# EAGLE schematic powersensor (EAGLE 7.7.0)
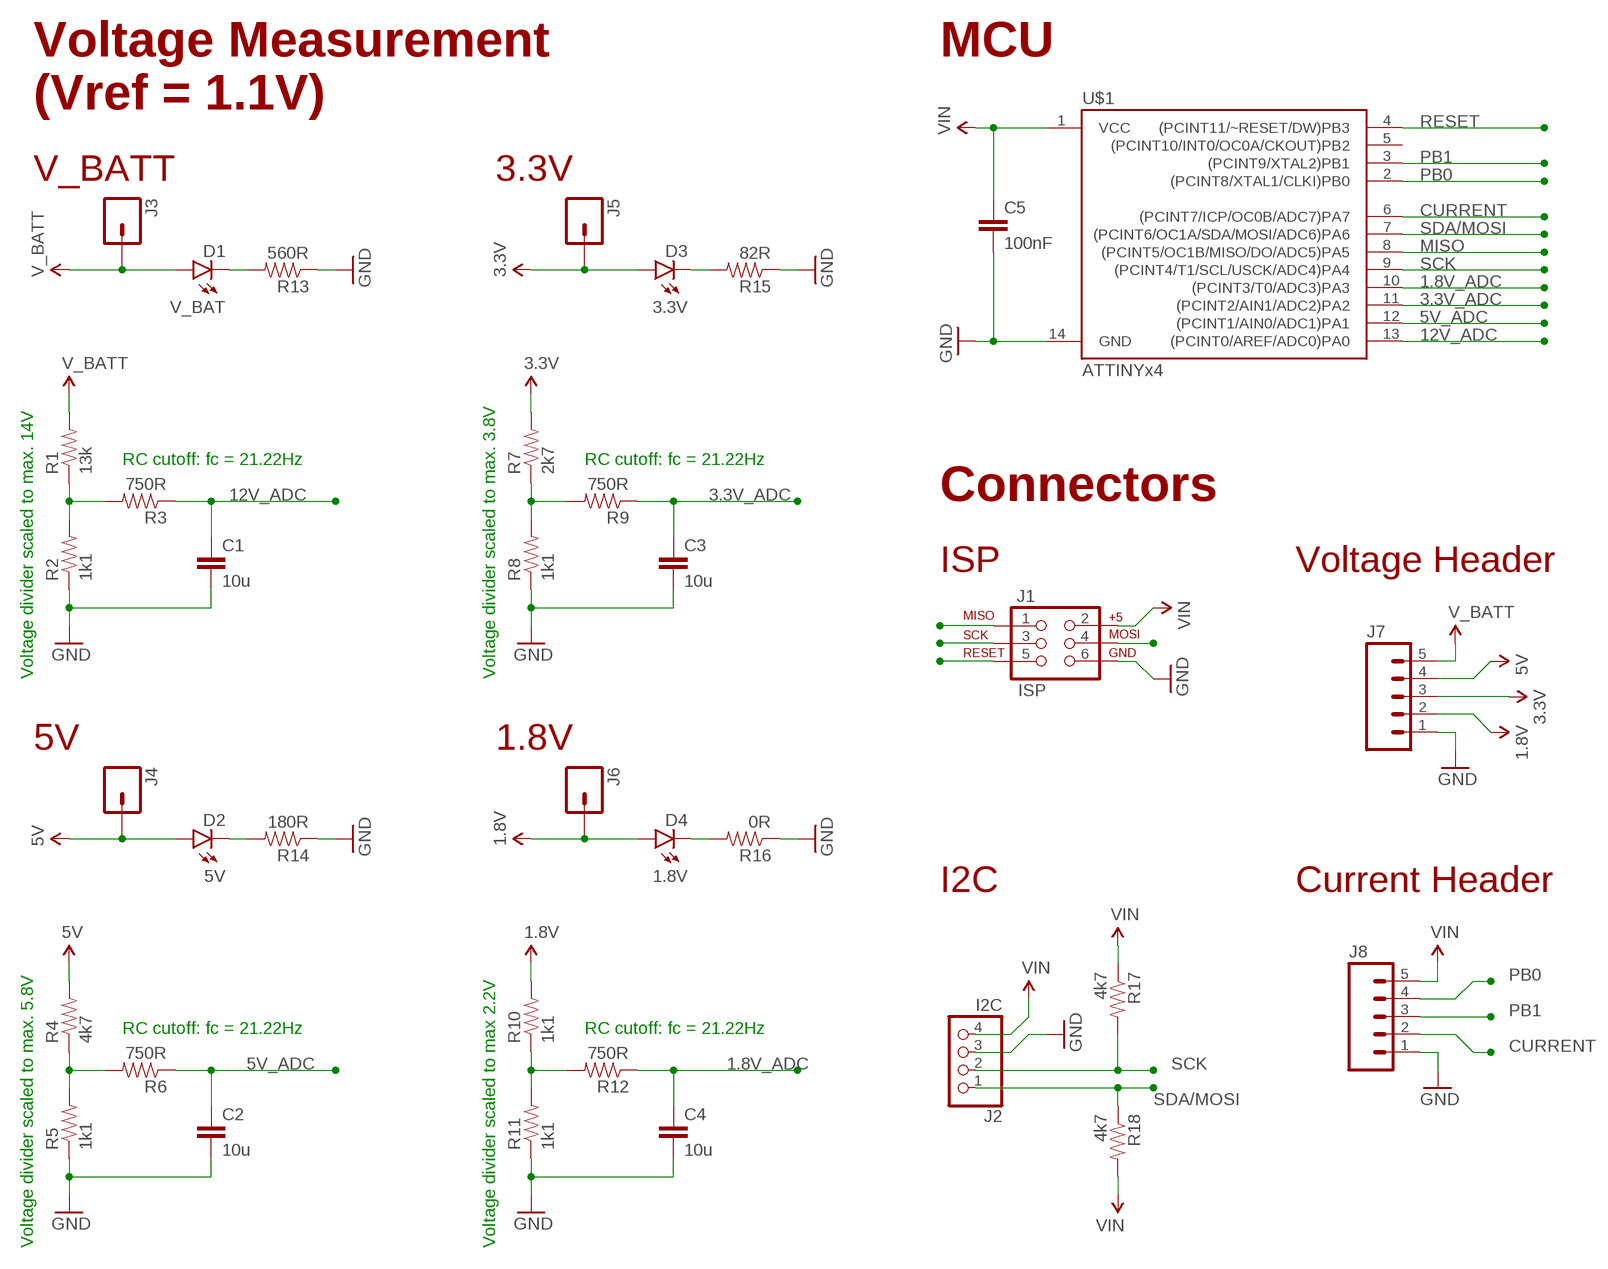
[diagram p0: schematic, sheet 1]

## Parts
C1  10u  CAP0603-CAP  [0603-CAP]
C2  10u  CAP0603-CAP  [0603-CAP]
C3  10u  CAP0603-CAP  [0603-CAP]
C4  10u  CAP0603-CAP  [0603-CAP]
C5  100nF  CAP0603-CAP  [0603-CAP]
D1  V_BAT  LED0603  [LED-0603]
D2  5V  LED0603  [LED-0603]
D3  3.3V  LED0603  [LED-0603]
D4  1.8V  LED0603  [LED-0603]
J1  ISP  AVR_SPI_PRG_6PTH  [2X3]
J2  I2C  PINHD-1X4/90  [1X04/90]
J3  M01PTH  [1X01]
J4  M01PTH  [1X01]
J5  M01PTH  [1X01]
J6  M01PTH  [1X01]
J7  M05PTH  [1X05]
J8  M05PTH  [1X05]
R1  13k  RESISTOR0603-RES  [0603-RES]
R2  1k1  RESISTOR0603-RES  [0603-RES]
R3  750R  RESISTOR0603-RES  [0603-RES]
R4  4k7  RESISTOR0603-RES  [0603-RES]
R5  1k1  RESISTOR0603-RES  [0603-RES]
R6  750R  RESISTOR0603-RES  [0603-RES]
R7  2k7  RESISTOR0603-RES  [0603-RES]
R8  1k1  RESISTOR0603-RES  [0603-RES]
R9  750R  RESISTOR0603-RES  [0603-RES]
R10  1k1  RESISTOR0603-RES  [0603-RES]
R11  1k1  RESISTOR0603-RES  [0603-RES]
R12  750R  RESISTOR0603-RES  [0603-RES]
R13  560R  RESISTOR0603-RES  [0603-RES]
R14  180R  RESISTOR0603-RES  [0603-RES]
R15  82R  RESISTOR0603-RES  [0603-RES]
R16  0R  RESISTOR0603-RES  [0603-RES]
R17  4k7  RESISTOR0603-RES  [0603-RES]
R18  4k7  RESISTOR0603-RES  [0603-RES]
U$1  ATTINYx4  ATTINY84  [SO14]

## Nets
1.8V: D4.A J6.1 J7.2 R10.2
1.8V_ADC: C4.1 R12.1 U$1.10((PCINT3/T0/ADC3)PA3)
3.3V: D3.A J5.1 J7.3 R7.2
3.3V_ADC: C3.1 R9.1 U$1.11((PCINT2/AIN1/ADC2)PA2)
5V: D2.A J4.1 J7.4 R4.2
5V_ADC: C2.1 R6.1 U$1.12((PCINT1/AIN0/ADC1)PA1)
12V_ADC: C1.1 R3.1 U$1.13((PCINT0/AREF/ADC0)PA0)
CURRENT: J8.2 U$1.6((PCINT7/ICP/OC0B/ADC7)PA7)
GND: C1.2 C2.2 C3.2 C4.2 C5.2 J1.6 J2.3 J7.1 J8.1 R2.1 R5.1 R8.1 R11.1 R13.1 R14.1 R15.1 R16.1 U$1.14(GND)
MISO: J1.1 U$1.8((PCINT5/OC1B/MISO/DO/ADC5)PA5)
N$1: R1.1 R2.2 R3.2
N$2: R4.1 R5.2 R6.2
N$3: R7.1 R8.2 R9.2
N$4: R10.1 R11.2 R12.2
N$5: D1.C R13.2
N$6: D2.C R14.2
N$7: D3.C R15.2
N$8: D4.C R16.2
PB0: J8.4 U$1.2((PCINT8/XTAL1/CLKI)PB0)
PB1: J8.3 U$1.3((PCINT9/XTAL2)PB1)
RESET: J1.5 U$1.4((PCINT11/~RESET/DW)PB3)
SCK: J1.3 J2.2 R17.2 U$1.9((PCINT4/T1/SCL/USCK/ADC4)PA4)
SDA/MOSI: J1.4 J2.1 R18.1 U$1.7((PCINT6/OC1A/SDA/MOSI/ADC6)PA6)
V_BATT: D1.A J3.1 J7.5 R1.2
VIN: C5.1 J1.2 J2.4 J8.5 R17.1 R18.2 U$1.1(VCC)
Unconnected: U$1.5((PCINT10/INT0/OC0A/CKOUT)PB2)

## Notes on the sheet
- MCU
- Voltage Measurement
  (Vref = 1.1V)
- V_BATT | 3.3V
- RC cutoff: fc = 21.22Hz | RC cutoff: fc = 21.22Hz
- Connectors
- ISP | Voltage Header
- Voltage divider scaled to max. 14V | Voltage divider scaled to max. 3.8V
- 5V | 1.8V
- I2C | Current Header
- RC cutoff: fc = 21.22Hz | RC cutoff: fc = 21.22Hz
- Voltage divider scaled to max. 5.8V | Voltage divider scaled to max 2.2V

## Library data of the parts
C1-C5 = SparkFun-Capacitors:CAP: Capacitor Standard 0603 ceramic capacitor, and 0.1" leaded capacitor.
D1-D4 = SparkFun-LED:LED: LEDs Standard schematic elements and footprints for 5mm, 3mm, 1206, and 0603 sized LEDs. 5mm - Spark Fun Electronics SKU : COM-00529 (and others)
J1 = SparkFun-Connectors:AVR_SPI_PRG_6: AVR ISP 6 Pin This is the reduced ISP connector for AVR programming. Common on Arduino. This footprint will take up less PCB space and can be used with a 10-pin to 6-pin adapter such as SKU: BOB-08508 **Special note about "TEST_POINT" package. The stop mask is on the top side, so if you want your programming test points to be on the bottom of your board, make sure to place this package on the bottom side of the board. This also ensure that the orientation to program from the bottom side will be correct.
J2 = pinhead:PINHD-1X4: PIN HEADER
J3-J6 = SparkFun-Connectors:M01: Header 1 Standard 1-pin 0.1" header. Use with straight break away headers (SKU : PRT-00116), right angle break away headers (PRT-00553), swiss pins (PRT-00743), machine pins (PRT-00117), and female headers (PRT-00115). SMTSO-256-ET is a "flush mount" nut for a 4-40 screw. The older package used to be too tight, and did not allow it to sit properly thru the drill hit. The latest (0.165DIA) fits nice and snug.
J7 J8 = SparkFun-Connectors:M05: Header 5 Standard 5-pin 0.1" header. Use with straight break away headers (SKU : PRT-00116), right angle break away headers (PRT-00553), swiss pins (PRT-00743), machine pins (PRT-00117), and female headers (PRT-00115). Molex polarized connector foot print use with SKU : PRT-08230 with associated crimp pins and housings.
R1-R18 = SparkFun-Passives:RESISTOR: Resistor Basic schematic elements and footprints for 0603, 1206, and PTH resistors.
U$1 = SparkFun-DigitalIC:ATTINY84: Atmel 14-pin 2/4/8kB flash uC; PROD_ID: IC-11285